# Altium project OMRHydroADC.PrjPcb
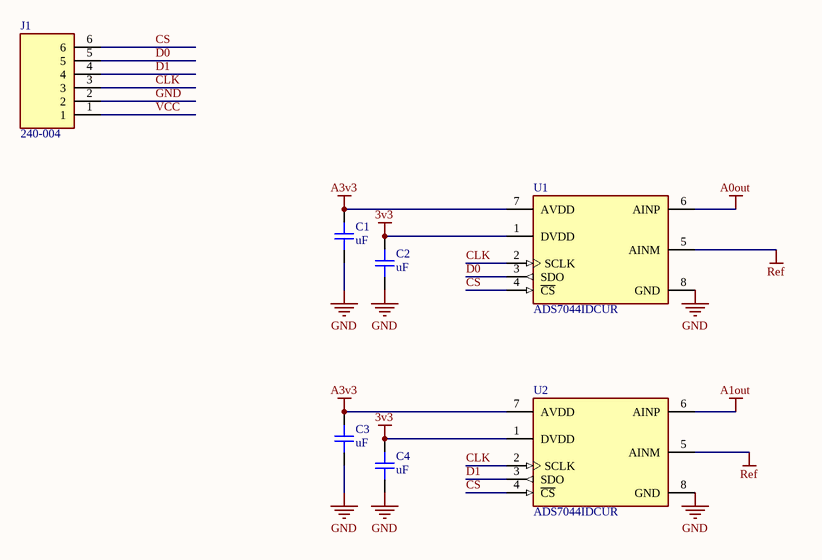
[diagram p0: ADC.SchDoc]
3 sheets, 43 parts. Net scope: global (net labels, ports and power ports of the same name join across sheets).
Board file: PCBOKMR.PcbDoc
Sheets:
  ADC.SchDoc
  Filter.SchDoc
  Filter2.SchDoc

## Sheet ADC.SchDoc
size A; SheetNumber: 1; SheetTotal: 3

### Parts
C1  uF  [CAP_0603]
C2  uF  [CAP_0603]
C3  uF  [CAP_0603]
C4  uF  [CAP_0603]
J1  240-004  [HDRV6W64P0X254_1X6_1524X254X909P]
U1  ADS7044IDCUR  [FP-DCU0008A-MFG]
U2  ADS7044IDCUR  [FP-DCU0008A-MFG]

### Nets
3v3: C2.2 C4.2 U1.1(DVDD) U2.1(DVDD)
A0out: U1.6(AINP)
A1out: U2.6(AINP)
A3v3: C1.2 C3.2 U1.7(AVDD) U2.7(AVDD)
GND: C1.1 C2.1 C3.1 C4.1 J1.2 U1.8(GND) U2.8(GND)
Ref: U1.5(AINM) U2.5(AINM)
CLK: J1.3 U1.2(SCLK) U2.2(SCLK)
CS: J1.6 U1.4(~{CS}) U2.4(~{CS})
D0: J1.5 U1.3(SDO)
D1: J1.4 U2.3(SDO)
VCC: J1.1

### Library data of the parts
C1-C4 = CAP_0603: Capacitor SMD 0603; Manufacturer: *; Manufacturer Part Number: *; Distributor Link: *; LCSC: *; Rating: *; Dielectric: *
J1 = 240-004: Connector; Manufacturer_Name: Digilent; Datasheet Link: https://digilent.com/reference/_media/reference/test-and-measurement/6-pin-header-gender-changer/163-068-2.pdf; Height: 9.09mm; Manufacturer_Part_Number: 240-004; Arrow Part Number: 240-004; Arrow Price/Stock: https://www.arrow.com/en/products/240-004/digilent?region=nac
U1 U2 = CMP-04860-000057-1: IC ADC 12BIT SAR 8VSSOP; Resolution: 12b; Max Dual Supply Voltage: 3.6V; Polarity: Unipolar; Number of Bits: 12; Max Power Dissipation: 900uW; Integral Nonlinearity (INL): 2LSB; Operating Supply Voltage: 3V; Supply Type: Analog; Sampling Rate: 1000000S/s; Number of Inputs: 1; Interface: SPI; Min Dual Supply Voltage: 1.8V; Signal to Noise Ratio (SNR): 71dB; Number of Pins: 8; Min Operating Temperature: -40°C; RoHS Compliant: Yes; Mount: Surface Mount; Max Operating Temperature: 125°C; Contact Plating: Gold; Number of Analog Inputs: 1; Max Supply Voltage: 3.6V; Packaging: Tape and Reel; Number of A/D Converters: 1; Lead Free: Lead Free

## Sheet Filter.SchDoc
size A; SheetNumber: 2; SheetTotal: 3
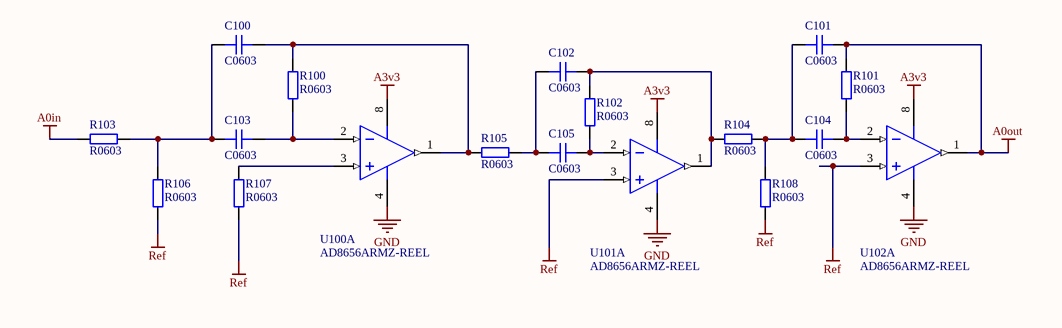
[diagram p1: Filter.SchDoc]

### Parts
C100  C0603  [CAP_0603]
C101  C0603  [CAP_0603]
C102  C0603  [CAP_0603]
C103  C0603  [CAP_0603]
C104  C0603  [CAP_0603]
C105  C0603  [CAP_0603]
R100  R0603  [RES_0603]
R101  R0603  [RES_0603]
R102  R0603  [RES_0603]
R103  R0603  [RES_0603]
R104  R0603  [RES_0603]
R105  R0603  [RES_0603]
R106  R0603  [RES_0603]
R107  R0603  [RES_0603]
R108  R0603  [RES_0603]
U100  AD8656ARMZ-REEL  [ADI-RM-8_N]  (part A of 2)
U101  AD8656ARMZ-REEL  [ADI-RM-8_N]  (part A of 2)
U102  AD8656ARMZ-REEL  [ADI-RM-8_N]  (part A of 2)

### Nets
A0in: R103.2
A0out: C101.2 R101.2 U102.1(OUT_A)
A3v3: U100.8(+V) U101.8(+V) U102.8(+V)
GND: U100.4(-V) U101.4(-V) U102.4(-V)
Ref: R106.2 R107.1 R108.1 U101.3(+IN_A) U102.3(+IN_A)
NetC100_1: C100.1 C103.1 R103.1 R106.1
NetC100_2: C100.2 R100.2 R105.2 U100.1(OUT_A)
NetC101_1: C101.1 C104.1 R104.1 R108.2
NetC102_1: C102.1 C105.1 R105.1
NetC102_2: C102.2 R102.2 R104.2 U101.1(OUT_A)
NetC103_2: C103.2 R100.1 U100.2(-IN_A)
NetC104_2: C104.2 R101.1 U102.2(-IN_A)
NetC105_2: C105.2 R102.1 U101.2(-IN_A)
NetR107_2: R107.2 U100.3(+IN_A)

### Library data of the parts
C100-C105 = CAP_0603: Capacitor SMD 0603; Manufacturer: *; Manufacturer Part Number: *; Distributor Link: *; LCSC: *; Rating: *; Dielectric: *
R100-R108 = RES_0603: Resistor SMD 0603; Manufacturer: *; Manufacturer Part Number: *; Distributor Link: *; LCSC: *
U100-U102 = CMP-0384-01673-1: Double Channel RRIO Operational Amplifier, 28 MHz BW, 11 V/us SR, Industrial, 8-pin SOP (RM-8), Reel; Generic Part Number: AD8656; Manufacturer: Analog Devices; Input Bias Current: 1pA; Automotive Qualified: Yes; V Span Min: 2.7V; Iq/Amp: 4.5mA; Slew Rate: 11V/us; Input Offset Voltage: 50uV; Small Signal Bandwidth: 28MHz; V Span Max: 5.5V; Amplifiers Per Package: 2; ComponentLink3Description: Package Specification; ComponentLink2Description: Datasheet; Mounting Technology: Surface Mount; Code_JEDEC: MO-187-AA; PackageReference: RM-8; ComponentLink2URL: http://www.analog.com/static/imported-files/data_sheets/AD8655_8656.pdf; DatasheetVersion: Rev. B; ComponentLink1URL: http://www.analog.com/en/index.html; PartNumber: AD8656ARMZ-REEL; ComponentLink1Description: Manufacturer URL; ComponentLink3URL: http://www.analog.com/static/imported-files/packages/PKG_PDF/MSOP%28RM%29/RM_8.pdf; PackageDescription: 8-Pin Mini Small Outline Package, Body 3 x 3 mm, Pitch 0.65 mm

## Sheet Filter2.SchDoc
size A; SheetNumber: 3; SheetTotal: 3
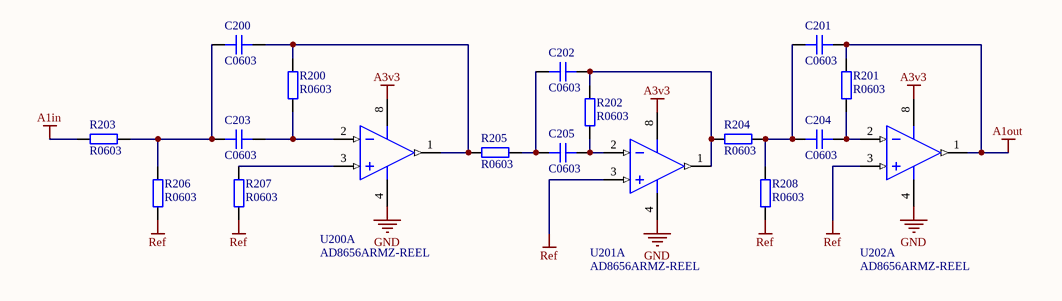
[diagram p2: Filter2.SchDoc]

### Parts
C200  C0603  [CAP_0603]
C201  C0603  [CAP_0603]
C202  C0603  [CAP_0603]
C203  C0603  [CAP_0603]
C204  C0603  [CAP_0603]
C205  C0603  [CAP_0603]
R200  R0603  [RES_0603]
R201  R0603  [RES_0603]
R202  R0603  [RES_0603]
R203  R0603  [RES_0603]
R204  R0603  [RES_0603]
R205  R0603  [RES_0603]
R206  R0603  [RES_0603]
R207  R0603  [RES_0603]
R208  R0603  [RES_0603]
U200  AD8656ARMZ-REEL  [ADI-RM-8_N]  (part A of 2)
U201  AD8656ARMZ-REEL  [ADI-RM-8_N]  (part A of 2)
U202  AD8656ARMZ-REEL  [ADI-RM-8_N]  (part A of 2)

### Nets
A1in: R203.2
A1out: C201.2 R201.2 U202.1(OUT_A)
A3v3: U200.8(+V) U201.8(+V) U202.8(+V)
GND: U200.4(-V) U201.4(-V) U202.4(-V)
Ref: R206.2 R207.1 R208.1 U201.3(+IN_A) U202.3(+IN_A)
NetC200_1: C200.1 C203.1 R203.1 R206.1
NetC200_2: C200.2 R200.2 R205.2 U200.1(OUT_A)
NetC201_1: C201.1 C204.1 R204.1 R208.2
NetC202_1: C202.1 C205.1 R205.1
NetC202_2: C202.2 R202.2 R204.2 U201.1(OUT_A)
NetC203_2: C203.2 R200.1 U200.2(-IN_A)
NetC204_2: C204.2 R201.1 U202.2(-IN_A)
NetC205_2: C205.2 R202.1 U201.2(-IN_A)
NetR207_2: R207.2 U200.3(+IN_A)

### Library data of the parts
C200-C205 = CAP_0603: Capacitor SMD 0603; Manufacturer: *; Manufacturer Part Number: *; Distributor Link: *; LCSC: *; Rating: *; Dielectric: *
R200-R208 = RES_0603: Resistor SMD 0603; Manufacturer: *; Manufacturer Part Number: *; Distributor Link: *; LCSC: *
U200-U202 = CMP-0384-01673-1: as U100 on sheet Filter; ComponentLink3Description: Package Specification; ComponentLink2Description: Datasheet; Mounting Technology: Surface Mount; Code_JEDEC: MO-187-AA; PackageReference: RM-8; ComponentLink2URL: http://www.analog.com/static/imported-files/data_sheets/AD8655_8656.pdf; DatasheetVersion: Rev. B; ComponentLink1URL: http://www.analog.com/en/index.html; PartNumber: AD8656ARMZ-REEL; ComponentLink1Description: Manufacturer URL; ComponentLink3URL: http://www.analog.com/static/imported-files/packages/PKG_PDF/MSOP%28RM%29/RM_8.pdf; PackageDescription: 8-Pin Mini Small Outline Package, Body 3 x 3 mm, Pitch 0.65 mm

## Nets that join several sheets
A0out: ADC (U1.6), Filter (C101.2 R101.2 U102.1)
A1out: ADC (U2.6), Filter2 (C201.2 R201.2 U202.1)
A3v3: ADC (C1.2 C3.2 U1.7 U2.7), Filter (U100.8 U101.8 U102.8), Filter2 (U200.8 U201.8 U202.8)
GND: ADC (7 pins), Filter (U100.4 U101.4 U102.4), Filter2 (U200.4 U201.4 U202.4)
Ref: ADC (U1.5 U2.5), Filter (5 pins), Filter2 (5 pins)